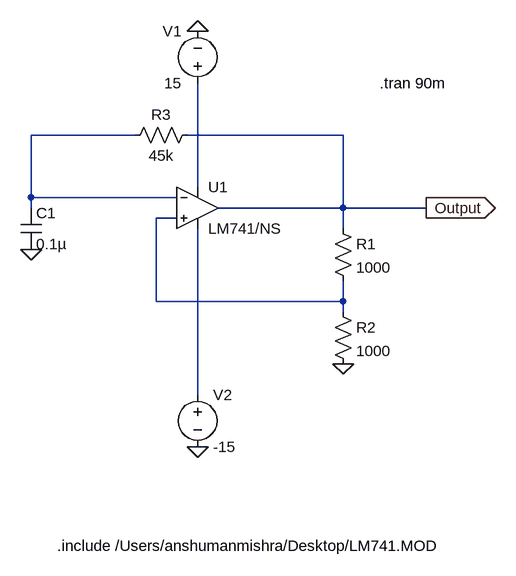
[diagram p0: schematic SQwave.asc]
SQwave.asc, the LTspice schematic file:
Version 4
SHEET 1 880 824
WIRE 304 176 144 176
WIRE 624 176 384 176
WIRE 400 256 400 96
WIRE 144 272 144 176
WIRE 368 272 144 272
WIRE 144 288 144 272
WIRE 624 288 624 176
WIRE 624 288 432 288
WIRE 752 288 624 288
WIRE 368 304 336 304
WIRE 624 320 624 288
WIRE 336 432 336 304
WIRE 624 432 624 400
WIRE 624 432 336 432
WIRE 624 448 624 432
WIRE 400 576 400 320
FLAG 400 16 0
FLAG 400 656 0
FLAG 752 288 Output
IOPIN 752 288 Out
FLAG 624 528 0
FLAG 144 352 0
SYMBOL opamp2 400 224 R0
SYMATTR InstName U1
SYMATTR Value LM741/NS
SYMBOL voltage 400 112 R180
WINDOW 0 24 96 Left 2
WINDOW 3 24 16 Left 2
SYMATTR InstName V1
SYMATTR Value 15
SYMBOL voltage 400 560 R0
SYMATTR InstName V2
SYMATTR Value -15
SYMBOL res 608 304 R0
SYMATTR InstName R1
SYMATTR Value 1000
SYMBOL res 608 432 R0
SYMATTR InstName R2
SYMATTR Value 1000
SYMBOL res 400 160 R90
WINDOW 0 0 56 VBottom 2
WINDOW 3 32 56 VTop 2
SYMATTR InstName R3
SYMATTR Value 45k
SYMBOL cap 128 288 R0
SYMATTR InstName C1
SYMATTR Value 0.1µ
TEXT 184 808 Left 2 !.include /Users/anshumanmishra/Desktop/LM741.MOD
TEXT 680 96 Left 2 !.tran 90m

The netlist it stands for:
* SQwave.asc
XU1 N003 N001 N002 N004 Output LM741/NS  ; pins In+ In- V+ V- OUT
V1 N002 0 15
V2 N004 0 -15
R1 Output N003 1000
R2 N003 0 1000
R3 Output N001 45k
C1 N001 0 0.1µ
.include /Users/anshumanmishra/Desktop/LM741.MOD
.tran 90m
.backanno
.end